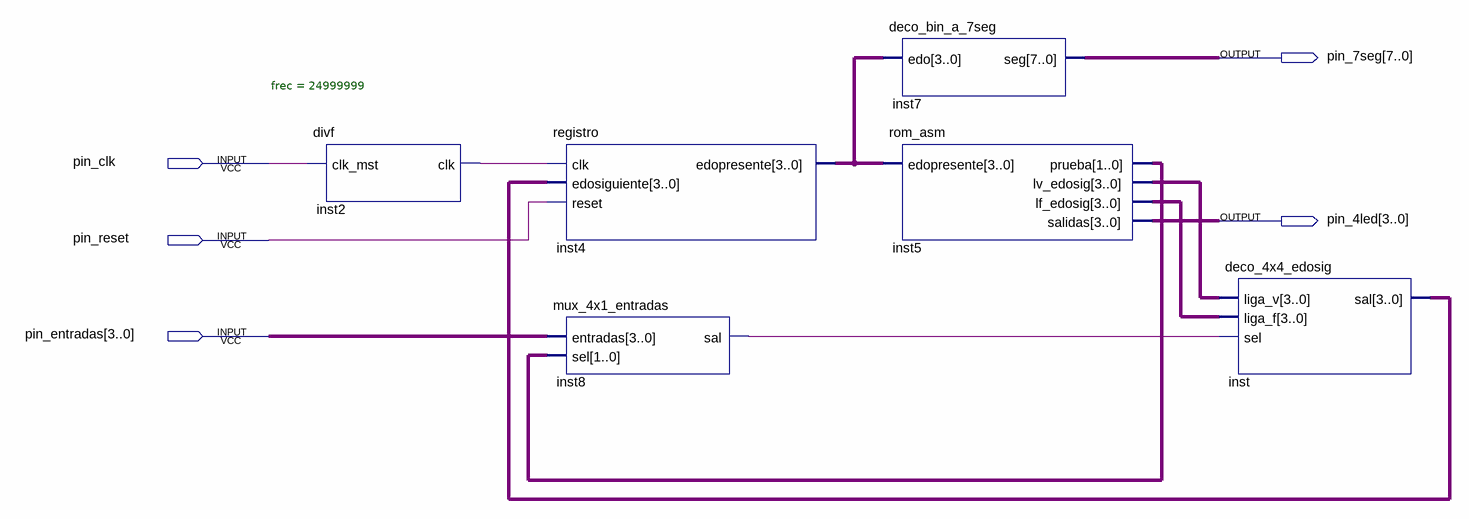
[diagram p0: schematic sheet]
// Quartus schematic practica03_main.bdf as structural Verilog: 6 symbols, 5 pins
module practica03_main (
  input  pin_clk,
  input  pin_reset,
  input  [3:0] pin_entradas,
  output [7:0] pin_7seg,
  output [3:0] pin_4led
);

  wire inst2_clk, inst8_sal;
  wire [1:0] inst5_prueba;
  wire [3:0] inst4_edopresente, inst5_lf_edosig, inst5_lv_edosig, inst_sal;

  divf #(.frec(24999999)) inst2 (.clk_mst(pin_clk), .clk(inst2_clk));
  registro inst4 (.clk(inst2_clk), .edosiguiente(inst_sal), .reset(pin_reset), .edopresente(inst4_edopresente));
  mux_4x1_entradas inst8 (.entradas(pin_entradas), .sel(inst5_prueba), .sal(inst8_sal));
  deco_bin_a_7seg inst7 (.edo(inst4_edopresente), .seg(pin_7seg));
  rom_asm inst5 (
    .edopresente(inst4_edopresente), .prueba(inst5_prueba), .lv_edosig(inst5_lv_edosig),
    .lf_edosig(inst5_lf_edosig), .salidas(pin_4led));
  deco_4x4_edosig inst (.liga_v(inst5_lv_edosig), .liga_f(inst5_lf_edosig), .sel(inst8_sal), .sal(inst_sal));
endmodule
